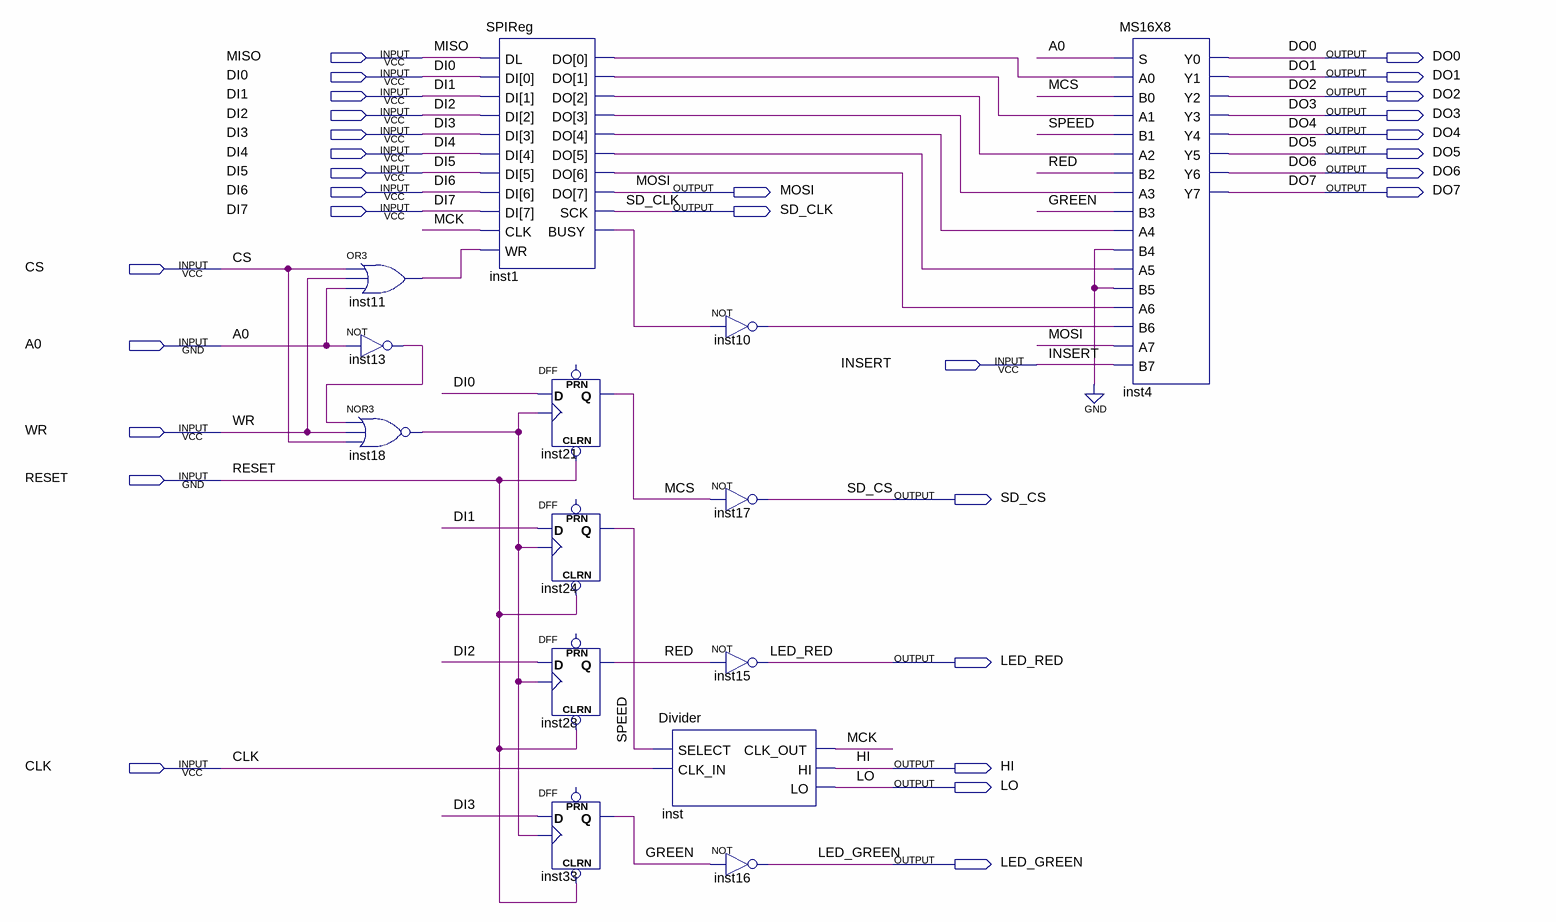
[diagram p0: schematic sheet]
// Quartus schematic SPI.bdf as structural Verilog: 14 symbols, 30 pins
module SPI (
  input  MISO,
  input  DI0,
  input  DI1,
  input  DI2,
  input  DI3,
  input  DI4,
  input  DI5,
  input  DI6,
  input  DI7,
  input  CS,
  input  A0,
  input  INSERT,
  input  WR,
  input  RESET,
  input  CLK,
  output DO0,
  output DO1,
  output DO2,
  output DO3,
  output DO4,
  output DO5,
  output DO6,
  output MOSI,
  output DO7,
  output SD_CLK,
  output SD_CS,
  output LED_RED,
  output HI,
  output LO,
  output LED_GREEN
);

  wire GREEN, inst1_busy, inst1_do, inst1_do_2, inst1_do_3, inst1_do_4, inst1_do_5, inst1_do_6, inst1_do_7,
       inst10_out, inst11_out, inst13_out, inst18_out, MCK, MCS, RED, SPEED;

  or inst11 (inst11_out, CS, WR, A0);
  not inst13 (inst13_out, A0);
  nor inst18 (inst18_out, inst13_out, WR, CS);
  SPIReg inst1 (
    .DL(MISO), .DI({DI7, DI6, DI5, DI4, DI3, DI2, DI1, DI0}), .CLK(MCK), .WR(inst11_out),
    .DO({MOSI, inst1_do, inst1_do_2, inst1_do_3, inst1_do_4, inst1_do_5, inst1_do_6, inst1_do_7}),
    .SCK(SD_CLK), .BUSY(inst1_busy));
  DFF inst21 (.CLRN(RESET), .CLK(inst18_out), .D(DI0), .Q(MCS));  // open: PRN
  DFF inst24 (.CLRN(RESET), .CLK(inst18_out), .D(DI1), .Q(SPEED));  // open: PRN
  DFF inst28 (.CLRN(RESET), .CLK(inst18_out), .D(DI2), .Q(RED));  // open: PRN
  DFF inst33 (.CLRN(RESET), .CLK(inst18_out), .D(DI3), .Q(GREEN));  // open: PRN
  Divider inst (.SELECT(SPEED), .CLK_IN(CLK), .CLK_OUT(MCK), .HI(HI), .LO(LO));
  not inst10 (inst10_out, inst1_busy);
  not inst17 (SD_CS, MCS);
  not inst15 (LED_RED, RED);
  not inst16 (LED_GREEN, GREEN);
  MS16X8 inst4 (
    .S(A0), .A0(inst1_do_7), .B0(MCS), .A1(inst1_do_6), .B1(SPEED), .A2(inst1_do_5), .B2(RED),
    .A3(inst1_do_4), .B3(GREEN), .A4(inst1_do_3), .B4(1'b0), .A5(inst1_do_2), .B5(1'b0), .A6(inst1_do),
    .B6(inst10_out), .A7(MOSI), .B7(INSERT), .Y0(DO0), .Y1(DO1), .Y2(DO2), .Y3(DO3), .Y4(DO4), .Y5(DO5),
    .Y6(DO6), .Y7(DO7));
endmodule
